# EAGLE design board_smart_switch (EAGLE 8.2.0)
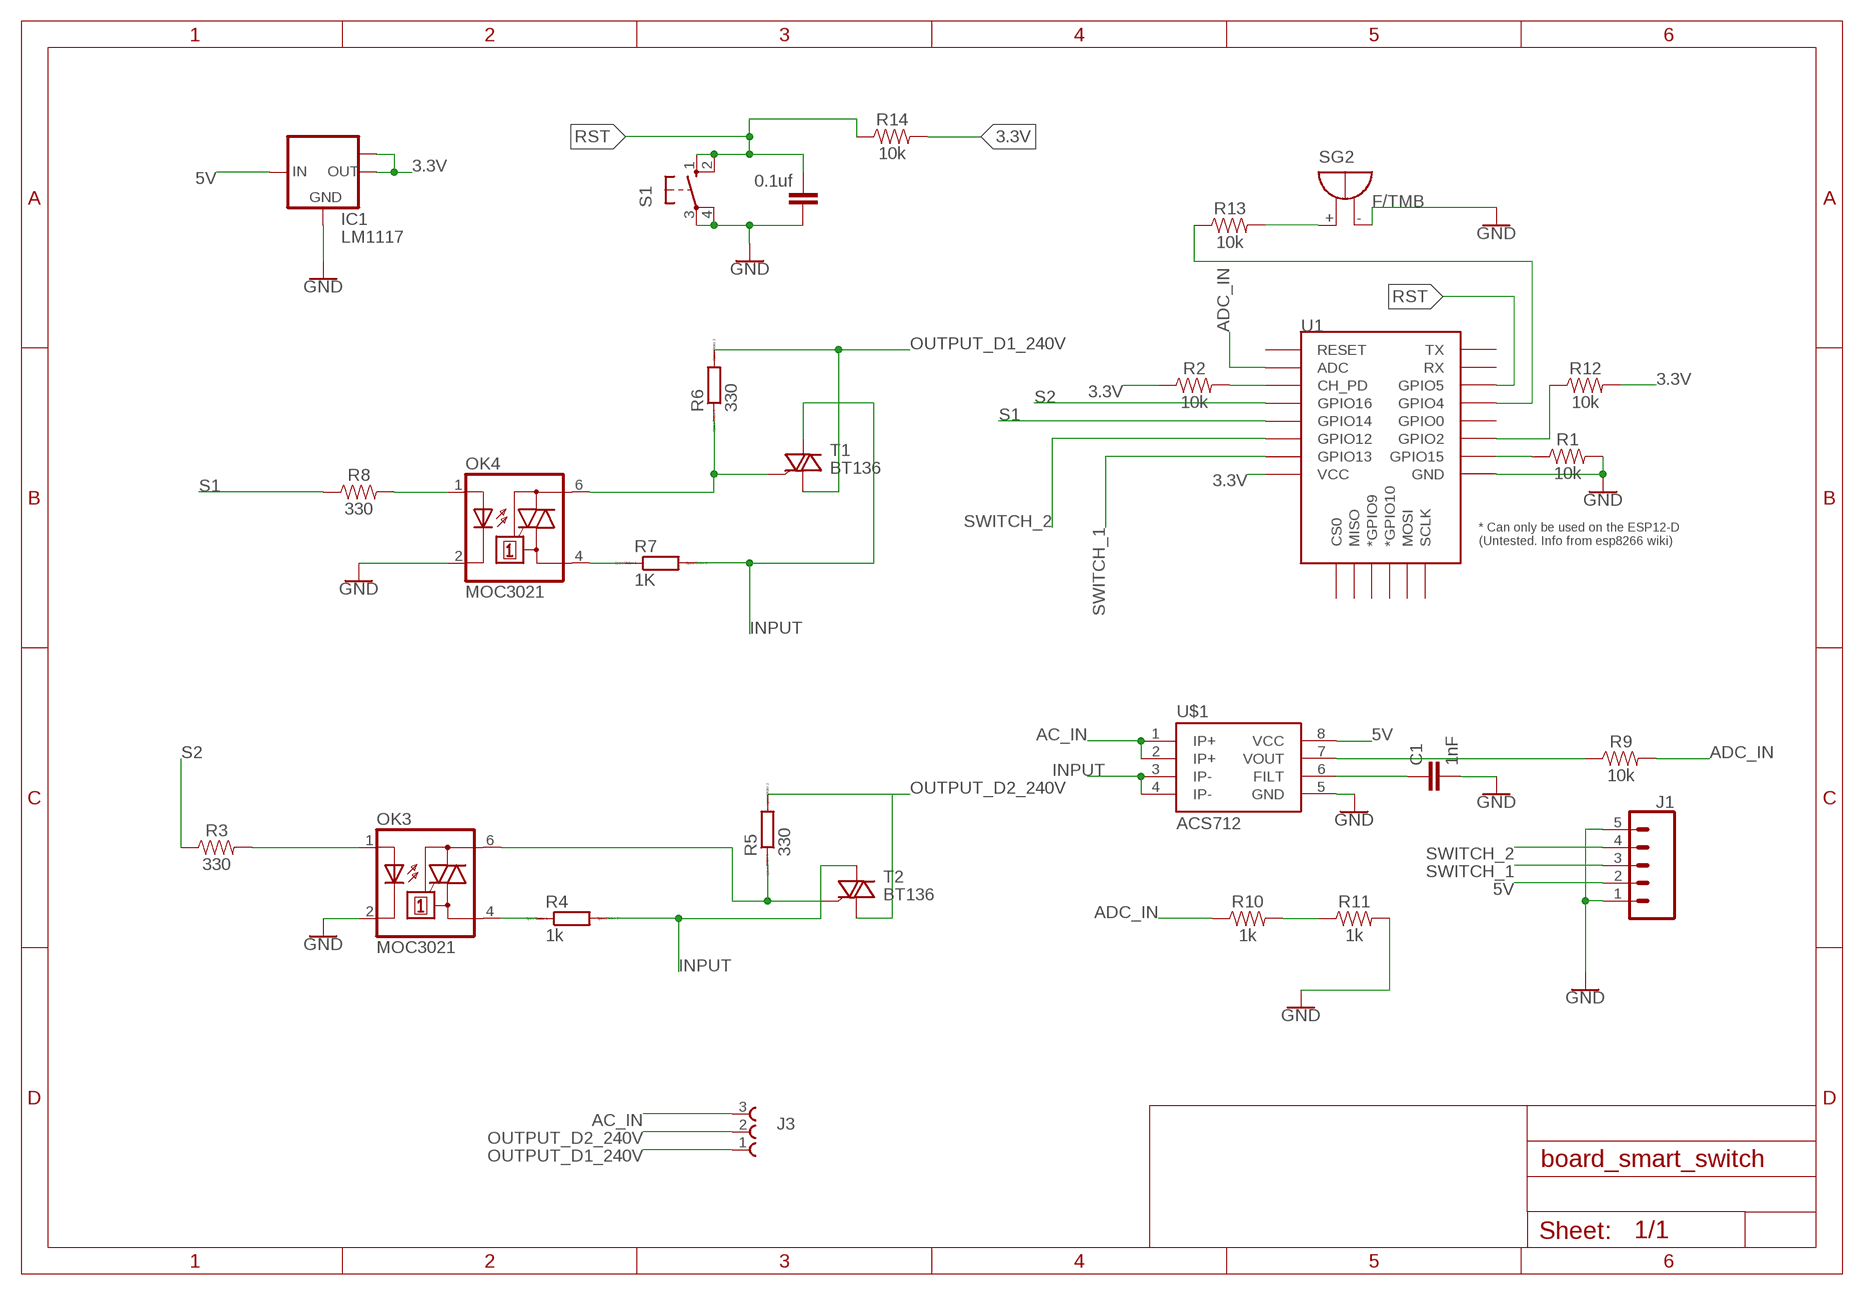
[diagram p0: schematic, sheet 1]

## Parts
C1  1nF  0.33UF/330NF-0805-50V-10%  [0805]
C2  0.1uf  0.33UF/330NF-0805-50V-10%  [0805]
IC1  LM1117  LM1117MPX-3.3  [SOT223]
J1  CONN_05JST  [JST-5-PTH]
J3  691104700003  [691104700003]
OK3  MOC3021  MOC3031S  [DIL6-SMD]
OK4  MOC3021  MOC3031S  [DIL6-SMD]
R1  10k  0.22OHM-0805-1/4W-1%  [0805]
R2  10k  0.22OHM-0805-1/4W-1%  [0805]
R3  330  0.22OHM-0805-1/4W-1%  [0805]
R4  1k  RR2512  [R2512]
R5  330  RR2512  [R2512]
R6  330  RR2512  [R2512]
R7  1K  RR2512  [R2512]
R8  330  0.22OHM-0805-1/4W-1%  [0805]
R9  10k  0.22OHM-0805-1/4W-1%  [0805]
R10  1k  0.22OHM-0805-1/4W-1%  [0805]
R11  1k  0.22OHM-0805-1/4W-1%  [0805]
R12  10k  0.22OHM-0805-1/4W-1%  [0805]
R13  10k  0.22OHM-0805-1/4W-1%  [0805]
R14  10k  0.22OHM-0805-1/4W-1%  [0805]
S1  10-XX  [B3F-10XX]
SG2  F/TMB  [F/TMB]
T1  BT136  [TO220AB]
T2  BT136  [TO220AB]
U1  ESP12ESMD  [ESP12E-SMD]
U$1  ACS712  [SO08]

## Nets
3.3V: IC1.2(OUT) IC1.TAB(OUT1) R2.1 R12.2 R14.2 U1.VCC
5V: IC1.3(IN) J1.2 U$1.8(VCC)
AC_IN: J3.3 U$1.1(IP+) U$1.2(IP+)
ADC_IN: R9.2 R10.1 U1.ADC
GND: C1.2 C2.1 IC1.1(GND) J1.1 J1.5 OK3.2(C) OK4.2(C) R1.2 R11.2 S1.3(P) S1.4(P1) SG2.- U1.GND U$1.5(GND)
INPUT: R4.2 R7.2 T1.2(A2) T2.2(A2) U$1.3(IP-) U$1.4(IP-)
N$1: OK4.1(A) R8.2
N$2: OK3.1(A) R3.2
N$3: R2.2 U1.CH_PD
N$4: R1.1 U1.GPIO15
N$5: OK4.4(A1) R7.1
N$6: OK3.6(A2) R5.1 T2.3(G)
N$7: C1.1 U$1.6(FILT)
N$8: OK3.4(A1) R4.1
N$9: OK4.6(A2) R6.1 T1.3(G)
N$10: R9.1 U$1.7(VOUT)
N$11: R10.2 R11.1
N$12: R12.1 U1.GPIO2
N$13: R13.2 SG2.+
N$14: R13.1 U1.GPIO4
OUTPUT_D1_240V: J3.1 R6.2 T1.1(A1)
OUTPUT_D2_240V: J3.2 R5.2 T2.1(A1)
RST: C2.2 R14.1 S1.1(S) S1.2(S1) U1.GPIO5
S1: R8.1 U1.GPIO14
S2: R3.1 U1.GPIO16
SWITCH_1: J1.3 U1.GPIO13
SWITCH_2: J1.4 U1.GPIO12
Unconnected: U1.CS0 U1.GPIO0 U1.GPIO9(*GPIO9) U1.GPIO10(*GPIO10) U1.MISO U1.MOSI U1.RESET U1.RXD0(RX) U1.SCLK U1.TXD0(TX)

## Library data of the parts
C1 C2 = SparkFun-Capacitors:0.33UF/330NF: 0.33µF/330nF ceramic capacitors A capacitor is a passive two-terminal electrical component used to store electrical energy temporarily in an electric field.; PROD_ID: CAP-08469; VALUE: 0.33µF
IC1 = lm1117:LM1117MPX-*
J1 = SparkFun-Connectors:CONN_05: Multi connection point. Often used as Generic Header-pin footprint for 0.1 inch spaced/style header connections On any of the 0.1 inch spaced packages, you can populate with these: Break Away Headers - Straight <https://www.sparkfun.com/products/116> (PRT-00116) Break Away Male Headers - Right Angle <https://www.sparkfun.com/products/553> (PRT-00553) Female Headers <https://www.sparkfun.com/products/115> (PRT-00115) Break Away Headers - Machine Pin <https://www.sparkfun.com/products/117> (PRT-00117) Break Away Female Headers - Swiss Machine Pin <https://www.sparkfun.com/products/743> (PRT-00743) For SCREWTERMINALS and SPRING TERMINALS visit here: Screw Terimnals on SparkFun.com <https://www.sparkfun.com/search/results?term=Screw+Terminals> (5mm/3.5mm/2.54mm spacing) This device is also useful as a general connection point to wire up your design to another part of your project. Our various solder wires solder well into these plated through hole pads. Hook-Up Wire - Assortment (Stranded, 22 AWG) <https://www.sparkfun.com/products/11375> (PRT-11375) Hook-Up Wire - Assortment (Solid Core, 22 AWG) <https://www.sparkfun.com/products/11367> (PRT-11367) View the entire wire category on our website here <https://www.sparkfun.com/categories/141> Special notes: Molex polarized connector foot print use with SKU : PRT-08231 with associated crimp pins and housings. 1MM SMD Version SKU: PRT-10208; SF_ID: PRT-09917
J3 = EAGLE-TERMINAL_BLOCKS-rev17a:691104700003: WR-TBL Serie 1047 - 5.0mm Horizontal Entry Modular with Pressure Clamp - 1.5mm2 Wires, 3 Pins=>Code : Con_TBL_Screw_PressureClamp_691104700003 <http://katalog.we-online.de/media/images/eican/Con_TBL_Screw_PressureClamp_6911047000xx_pf2.jpg> Details see: http://katalog.we-online.de/en/em/691_104_700_0xx Created 2014-06-17, Karrer Zheng 2014 (C) Würth Elektronik
OK3 OK4 = optocoupler:MOC30*: 6-Pin DIP Zero-Cross Optoisolators Triac Driver Output (250/400 Volt Peak) Source: Data sheet <http://www.fairchildsemi.com/ds/MO/MOC3031M.pdf> The old path of data sheet not more available 2013-05-06.; MF: FAIRCHILD SEMICONDUCTOR; MPN: MOC3031SM; OC_FARNELL: unknown; OC_NEWARK: 34C1335
R1-R3 R8-R14 = SparkFun-Resistors:0.22OHM: 0.22Ω resistor A resistor is a passive two-terminal electrical component that implements electrical resistance as a circuit element. Resistors act to reduce current flow, and, at the same time, act to lower voltage levels within circuits. - Wikipedia; PROD_ID: RES-09883; VALUE: 0.22
R4-R7 = eagle-ltspice:R: RESISTOR, European symbol; SPICEMODEL: NONE; SPICEPREFIX: R
S1 = switch-omron:10-XX: OMRON SWITCH; MPN: B3F-1000; OC_FARNELL: 176432; OC_NEWARK: 36M3542
SG2 = buzzer:F/TMB: BUZZER Source: Buerklin; OC_FARNELL: unknown; OC_NEWARK: unknown
T1 T2 = triac:BT136: Triac BT136 series E sensitive gate Source: http://www.nxp.com/acrobat_download/datasheets/BT136_SERIES_E_2.pdf
U1 = esp8266modules:ESP12E: ESP12E Module
U$1 = SparkFun-Sensors:ACS712: ACS712 Hall-effect-based isolated linear current sensor Datasheet <http://www.sparkfun.com/datasheets/BreakoutBoards/0712.pdf> SparkFun Products SparkFun Low Current Sensor Breakout - ACS712 <https://www.sparkfun.com/products/8883> (SEN-08883); PROD_ID: IC-08964

## Board
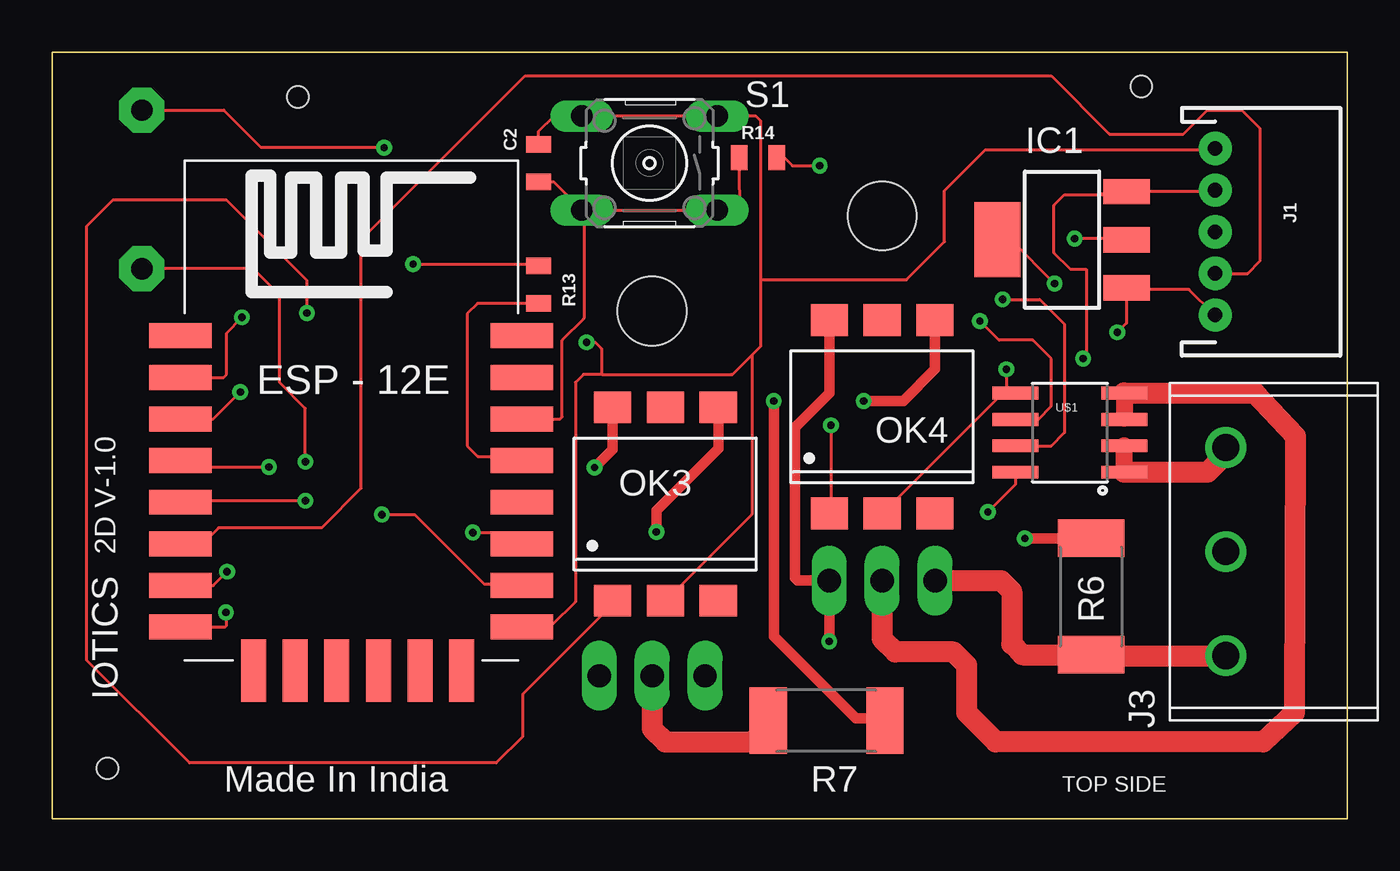
[diagram p1: board, top side]
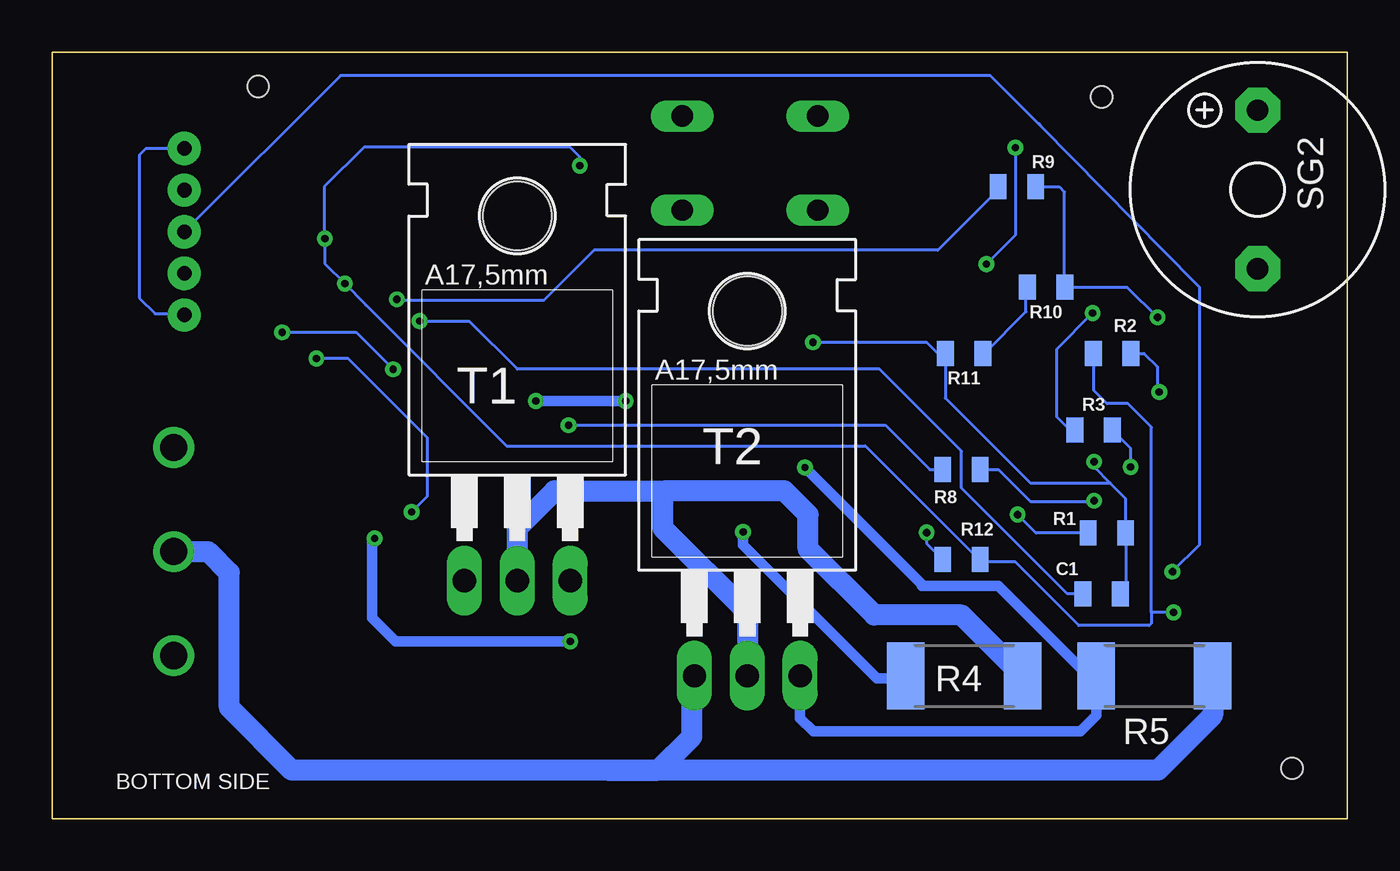
[diagram p2: board, bottom side, seen from below]

Size 62.23 x 36.83 mm. Coordinates in mm from the lower left corner, seen from the top.
Outline: 0,0 17.78,0 19.05,0 62.23,0 62.23,36.83 0,36.83 0,0
Copper layers (1*16): Top 0.035mm / dielectric 1.5mm / Bottom 0.035mm
Design rules "default": minimum track width 6mil, minimum drill 0.35mm, track to track 6mil, track to pad 6mil, pad to pad 6mil, via to via 6mil, smd to smd 6mil, copper to edge 40mil, drill to drill 6mil, minimum pad ring 10mil, minimum via ring 8mil, stop-mask expansion 4mil, vias tented up to drill 0mil, thermal gap 10mil
Holes 1.02 mm at 2.67,2.41 52.32,35.18 11.81,34.67

### Footprints (pad centres in the part's own frame; a part is rotated, then mirrored left to right if it is on the bottom)
0805 = smd 0.8 x 1.2: 1 -0.9,0; 2 0.9,0
SOT223 = smd 1.219 x 2.235: 1 -2.311,-3.099; 2 0,-3.099; 3 2.311,-3.099 | smd 3.6 x 2.2: TAB 0,3.099
JST-5-PTH = drill 0.7 pad 1.6: 1 -4,0; 2 -2,0; 3 0,0; 4 2,0; 5 4,0
691104700003 = drill 1.3: 1 -5,0; 2 0,0; 3 5,0
DIL6-SMD = smd 1.78 x 1.52: 1 -2.54,-4.645; 2 0,-4.645; 3 2.54,-4.645; 4 2.54,4.645; 5 0,4.645; 6 -2.54,4.645
R2512 = smd 1.8 x 3.2: 1 -2.8,0; 2 2.8,0
B3F-10XX = drill 1.016 long: 1 -3.251,2.261; 2 3.251,2.261; 3 -3.251,-2.261; 4 3.251,-2.261
F/TMB = drill 1.016 pad 2.159 octagon: + 3.81,0; - -3.81,0
TO220AB = drill 1.118 long: 1 -2.54,-6.35; 2 0,-6.35; 3 2.54,-6.35 | hole 3.302: 0,11.176
ESP12E-SMD = smd 3 x 1.2: ADC -8.3,3.8; CH_PD -8.3,1.8; GND 8.1,-8.2; GPIO0 8.1,-2.2; GPIO2 8.1,-4.2; GPIO4 8.1,-0.2; GPIO5 8.1,1.8; GPIO12 -8.3,-4.2; GPIO13 -8.3,-6.2; GPIO14 -8.3,-2.2; GPIO15 8.1,-6.2; GPIO16 -8.3,-0.2; RESET -8.3,5.8; RXD0 8.1,3.8; TXD0 8.1,5.8; VCC -8.3,-8.2 | smd 1.2 x 3: CS0 -4.8,-10.3; GPIO9 -0.8,-10.3; GPIO10 1.2,-10.3; MISO -2.8,-10.3; MOSI 3.2,-10.3; SCLK 5.2,-10.3
SO08 = smd 0.61 x 2.21: 1 -1.905,-2.616; 2 -0.635,-2.616; 3 0.635,-2.616; 4 1.905,-2.616; 5 1.905,2.616; 6 0.635,2.616; 7 -0.635,2.616; 8 -1.905,2.616

### Placement (x,y rotation side)
C1  11.81,10.79 0 bottom
C2  23.37,31.5 270 top
IC1  48.51,27.81 90 top
J1  55.88,28.19 270 top
J3  56.39,12.83 90 top
OK3  29.46,15.11 0 top
OK4  39.88,19.3 0 top
R1  11.56,13.72 0 bottom
R2  11.3,22.35 0 bottom
R3  12.19,18.67 180 bottom
R4  18.41,6.86 0 bottom
R5  9.27,6.86 0 bottom
R6  49.91,10.67 270 top
R7  37.21,4.7 180 top
R8  18.54,16.76 180 bottom
R9  15.88,30.35 0 bottom
R10  14.48,25.53 180 bottom
R11  18.41,22.35 180 bottom
R12  18.54,12.45 0 bottom
R13  23.37,25.65 90 top
R14  33.91,31.75 0 top
S1  28.7,31.5 180 top
SG2  4.32,30.23 90 bottom
T1  39.88,17.78 0 bottom
T2  28.83,13.21 0 bottom
U1  14.48,17.4 0 top
U$1  48.9,18.54 90 top

### Tracks (layer width: path | path; a pad name or v marks a point on that pad's centre or on a via)
3.3V  (via drill 0.35)
  Top 0.152: v49.12,27.86 51.56,27.86 IC1.2 | 45.47,27.86 IC1.TAB 46.05,27.81 v48.16,25.7 | 6.3,9.27 U1.VCC 8.31,9.2 8.38,9.27 8.38,9.88 v8.36,9.91 | R14.2 35.18,31.75 35.56,31.37 v36.88,31.37
  Bottom 0.152: R2.1 12.09,22.23 | 12.33,22.48 R2.1 | 11.94,21.96 R2.1 | R2.1 12.19,20.57 11.56,19.94 10.54,19.94 9.41,18.81 9.41,9.91 | v36.88,31.37 36.88,31.8 37.34,32.26 47.24,32.26 49.15,30.35 49.15,27.89 v49.12,27.86 49.12,26.67 v48.16,25.7 47.14,24.66 40.39,17.91 23.16,17.91 17.73,12.47 R12.2 17.58,12.32 15.95,12.32 12.9,9.27 9.53,9.27 9.41,9.38 9.41,9.91 | v8.36,9.91 9.41,9.91
5V  (via drill 0.35)
  Top 0.152: 47.12,16.74 46.38,16.74 U$1.8 | 50.93,30 51.56,30 IC1.3 51.71,30.15 55.83,30.15 J1.2 | 50.93,30 50.34,30 | 50.93,30 50.9,29.97 48.64,29.97 48.13,29.46 48.13,27.18 48.92,26.39 49.68,26.39 49.68,22.25 v49.53,22.1 | 45.47,16.64 U$1.8 | U$1.8 46.28,16.05 v44.96,14.73
  Bottom 0.152: v49.53,22.1 48.01,22.1 44.2,18.29 44.2,15.49 v44.96,14.73
AC_IN
  Top 0.813: U$1.1 U$1.2
  Top 1.016: J3.3 56.39,17.53 55.5,16.64 U$1.1
ADC_IN  (via drill 0.35)
  Top 0.152: U1.ADC 8.24,21.2 8.38,21.34 8.38,23.32 v9.12,24.08
  Bottom 0.152: 13.61,25.58 R10.1 | 13.46,25.43 R10.1 | R9.2 13.84,30.35 13.59,30.1 R10.1 | R10.1 10.59,25.53 v9.12,24.08
GND  (via drill 0.35)
  Top 0.152: 23.22,9.27 22.61,9.27 U1.GND 23.17,9.2 23.24,9.27 24,9.27 25.15,10.41 25.15,20.95 25.53,21.34 26.42,21.34 | 46.1,20.4 46.23,20.4 U$1.5 | 46.1,20.4 45.62,20.4 39.98,14.76 OK4.2 | IC1.1 51.71,25.43 54.61,25.43 55.83,24.21 J1.5 | IC1.1 51.56,25.43 | 33.62,22.26 32.66,21.31 32.64,21.34 26.42,21.34 | 33.62,22.26 34.04,22.68 34.04,25.91 | J1.1 55.83,32.13 44.83,32.13 42.88,30.18 42.88,27.71 41.05,25.89 41.05,25.88 34.06,25.88 34.04,25.91 | IC1.1 51.61,23.8 v51.18,23.37 | 33.62,22.26 33.62,14.62 OK3.2 | v45.85,21.59 45.85,20.65 46.1,20.4 | v25.68,22.89 26.09,22.89 26.39,22.58 26.39,21.36 26.42,21.34 | v12.17,17.14 12.17,19.71 10.92,20.95 10.92,25.15 9.65,26.42 SG2.- | 34.04,25.91 34.04,33.53 33.81,33.76 S1.3 S1.4 | C2.1 23.37,33.02 24.13,33.78 25.43,33.78 | 25.43,33.78 S1.4 | S1.4 25.43,33.78
  Bottom 0.152: R11.2 19.25,22.23 19.3,22.17 | 55.98,24.21 J1.5 55.94,24.26 57.28,24.26 58.04,25.02 58.04,31.88 57.72,32.19 J1.1 | v51.18,23.37 47.62,23.37 v45.85,21.59 | 10.4,13.46 R1.2 | R1.2 10.66,15.36 11.42,16.12 | 11.42,16.12 11.43,16.13 15.24,16.13 19.32,20.2 R11.2 | R11.2 19.68,22.35 20.19,22.86 25.65,22.86 v25.68,22.89 | R1.2 10.66,11.05 C1.2 | 11.42,16.12 11.4,16.13 12.17,16.89 v12.17,17.14
INPUT
  Top 0.152: 51.56,19.18 U$1.3 | 51.56,20.4 U$1.4
  Top 0.508: 51.51,19.23 51.56,19.18
  Top 0.813: U$1.4 51.51,19.23
  Top 1.016: T2.2 28.83,4.32 29.46,3.68 33.66,3.68 34.16,4.19 34.16,4.45 R7.2 | U$1.4 57.78,20.45 59.73,18.38 | 59.73,18.38 | 59.73,18.38 59.68,5.08 58.18,3.68 45.34,3.68 43.94,5.08 43.94,7.37 43.31,8 40.51,8 39.88,8.64 T1.2
  Bottom 0.152: 15.75,6.99 R4.2
  Bottom 1.016: R4.2 18.54,9.78 22.73,9.78 25.91,12.95 25.91,14.61 27.05,15.75 32.77,15.75 | T2.2 28.83,9.91 32.89,13.97 32.89,15.62 32.77,15.75 | T1.2 39.88,13.97 38.1,15.75 32.77,15.75
N$1  (via drill 0.35)
  Top 0.152: 37.24,14.76 OK4.1 37.41,14.73 v37.41,18.9
  Bottom 0.152: 19.56,16.74 R8.2 20.07,16.76 22.2,18.9 v37.41,18.9
N$2  (via drill 0.35)
  Top 0.152: 26.87,10.34 OK3.1 26.92,10.29 22.61,5.97 22.61,3.94 21.34,2.67 6.6,2.67 1.65,7.62 1.65,28.45 2.92,29.72 8.38,29.72 12.24,25.86 v12.24,24.28
  Bottom 0.152: 13.09,18.43 R3.2 13.34,18.67 13.97,19.3 13.97,22.55 v12.24,24.28
N$3  (via drill 0.35)
  Top 0.152: U1.CH_PD 7.74,19.2 v9.04,20.5
  Bottom 0.152: 10.26,22.23 R2.2 9.78,22.35 9.14,21.72 9.14,20.52 v9.04,20.5
N$4  (via drill 0.35)
  Top 0.152: U1.GPIO15 22.45,11.25 20.78,11.25 17.42,14.61 v15.85,14.61
  Bottom 0.152: R1.1 14.96,13.72 v15.85,14.61
N$5  (via drill 0.35)
  Top 0.508: OK4.4 42.42,21.59 40.89,20.07 v38.99,20.07 | v34.67,20.07 34.67,8.76 38.61,4.83 39.88,4.83 R7.1
  Bottom 0.508: v38.99,20.07 v34.67,20.07
N$6  (via drill 0.35)
  Top 0.152: 27.03,19.63 OK3.6
  Top 0.508: OK3.6 26.92,17.73 v26.06,16.87
  Bottom 0.152: 12.85,6.99 12.09,6.99 R5.1
  Bottom 0.508: R5.1 12.45,6.86 16.76,11.18 20.45,11.18 20.45,11.25 v26.06,16.87 | T2.3 26.29,4.83 25.65,4.19 12.83,4.19 12.06,4.95 12.06,6.96 12.09,6.99
N$7  (via drill 0.35)
  Top 0.152: 46.84,19.18 U$1.6 47.37,19.18 48.01,19.81 48.01,22.1 47.12,22.99 45.49,22.99 v44.58,23.9
  Bottom 0.152: C1.1 13.46,10.79 18.54,15.88 18.54,17.65 22.48,21.59 39.88,21.59 42.16,23.88 44.55,23.88 v44.58,23.9
N$8  (via drill 0.35)
  Top 0.152: 31.9,19.63 OK3.4 32,19.43 | 29.08,13.82 v29.03,13.77
  Top 0.508: v29.03,13.77 29.03,14.81 32,17.78 OK3.4
  Bottom 0.152: 21.23,6.99 R4.1 21.47,6.6 21.84,6.6 | 29.01,13.77 v29.03,13.77
  Bottom 0.508: v29.03,13.77 29.03,13.16 22.61,6.73 21.6,6.73 21.47,6.6
N$9  (via drill 0.35)
  Top 0.152: 37.24,23.9 OK4.6 37.39,24.05 | R6.1
  Top 0.508: OK4.6 37.34,20.45 35.69,18.8 35.69,11.56 35.81,11.43 T1.3 v37.34,8.51 | R6.1 v46.74,13.47 v46.74,13.46
  Bottom 0.508: v46.74,13.46 46.86,13.34 46.86,9.65 45.72,8.51 v37.34,8.51
N$10  (via drill 0.35)
  Top 0.152: 46.35,18.01 U$1.7 48.01,17.91 48.64,18.54 48.64,23.75 47.45,24.94 v45.67,24.94
  Bottom 0.152: R9.1 16.77,30.21 19.68,27.3 36.2,27.3 38.61,24.89 45.62,24.89 v45.67,24.94
N$11
  Bottom 0.152: R10.2 15.44,25.43 15.44,24.36 17.42,22.38 R11.1
N$12  (via drill 0.35)
  Top 0.152: U1.GPIO2 22.45,13.08 21.79,13.74 v20.22,13.74
  Bottom 0.152: R12.1 19.56,12.47 | R12.1 19.44,12.71 | v20.22,13.74 20.22,13.22 R12.1
N$13  (via drill 0.35)
  Top 0.152: v17.35,26.64 23.29,26.64 R13.2 | v15.95,32.23 15.93,32.26 10.03,32.26 8.26,34.04 SG2.+
  Bottom 0.152: v15.95,32.23 15.95,28.04 v17.35,26.64
N$14
  Top 0.152: 23.44,24.66 R13.1 | R13.1 23.63,24.75 | R13.1 20.44,24.75 19.94,24.26 19.94,17.91 20.45,17.4 22.38,17.4 U1.GPIO4
OUTPUT_D1_240V
  Top 1.016: 50.93,7.83 J3.1 | 50.93,7.83 49.95,7.83 R6.2 46.61,7.87 46.1,8.38 46.1,10.92 45.59,11.43 T1.1 | 50.85,7.75 50.93,7.83
OUTPUT_D2_240V
  Bottom 0.152: 6.6,6.83 R5.2 | 56.29,12.78 J3.2
  Bottom 0.508: 6.47,5.85 R5.2
  Bottom 1.016: J3.2 54.74,12.83 53.72,11.81 53.72,5.33 50.71,2.32 35.56,2.32 | R5.2 6.47,4.96 9.11,2.32 35.56,2.32 | 35.56,2.32 33.11,2.32 31.5,3.94 31.5,6.73 T2.1
RST
  Top 0.152: R14.1 33.05,29.69 32.59,29.23 S1.1 S1.2 | 22.58,19.23 U1.GPIO5 24.41,19.2 24.51,19.3 24.51,22.99 25.53,24 25.58,24.05 25.58,29.11 S1.2 | C2.2 24.09,30.6 S1.2
S1  (via drill 0.35)
  Top 0.152: 6.6,15.52 6.3,15.21 U1.GPIO14 6.24,15.27 v12.17,15.27
  Bottom 0.152: 17.58,16.74 R8.1 16.76,16.76 15.24,15.24 12.19,15.24 v12.17,15.27
S2  (via drill 0.35)
  Top 0.152: v10.41,16.89 6.6,16.89 6.3,17.2 U1.GPIO16
  Bottom 0.152: R3.1 10.41,17.79 v10.41,16.89
SWITCH_1  (via drill 0.35)
  Top 0.152: U1.GPIO13 7.75,11.2 v8.41,11.86
  Bottom 0.152: 14.73,33.27 7.3,25.72 7.11,25.53 7.11,13.16 v8.41,11.86 | 14.73,33.27 14.86,33.4 | 14.73,33.27 15.75,34.29 17.16,35.7 48.37,35.7 J1.3
SWITCH_2
  Top 0.152: 6.3,13.23 U1.GPIO12 7.23,13.2 8,13.97 12.95,13.97 14.86,15.88 14.86,27.81 22.73,35.69 48.01,35.69 50.8,32.89 54.36,32.89 55.5,34.04 57.15,34.04 58.04,33.15 58.04,26.8 57.44,26.19 J1.4

### Text on the board
tNames: 2D V-1.0 | IOTICS | Made In India | TOP SIDE
bNames: BOTTOM SIDE